# Altium project VL812 QFN76 HUB P4 BC DEMO 20120829.PrjPcb
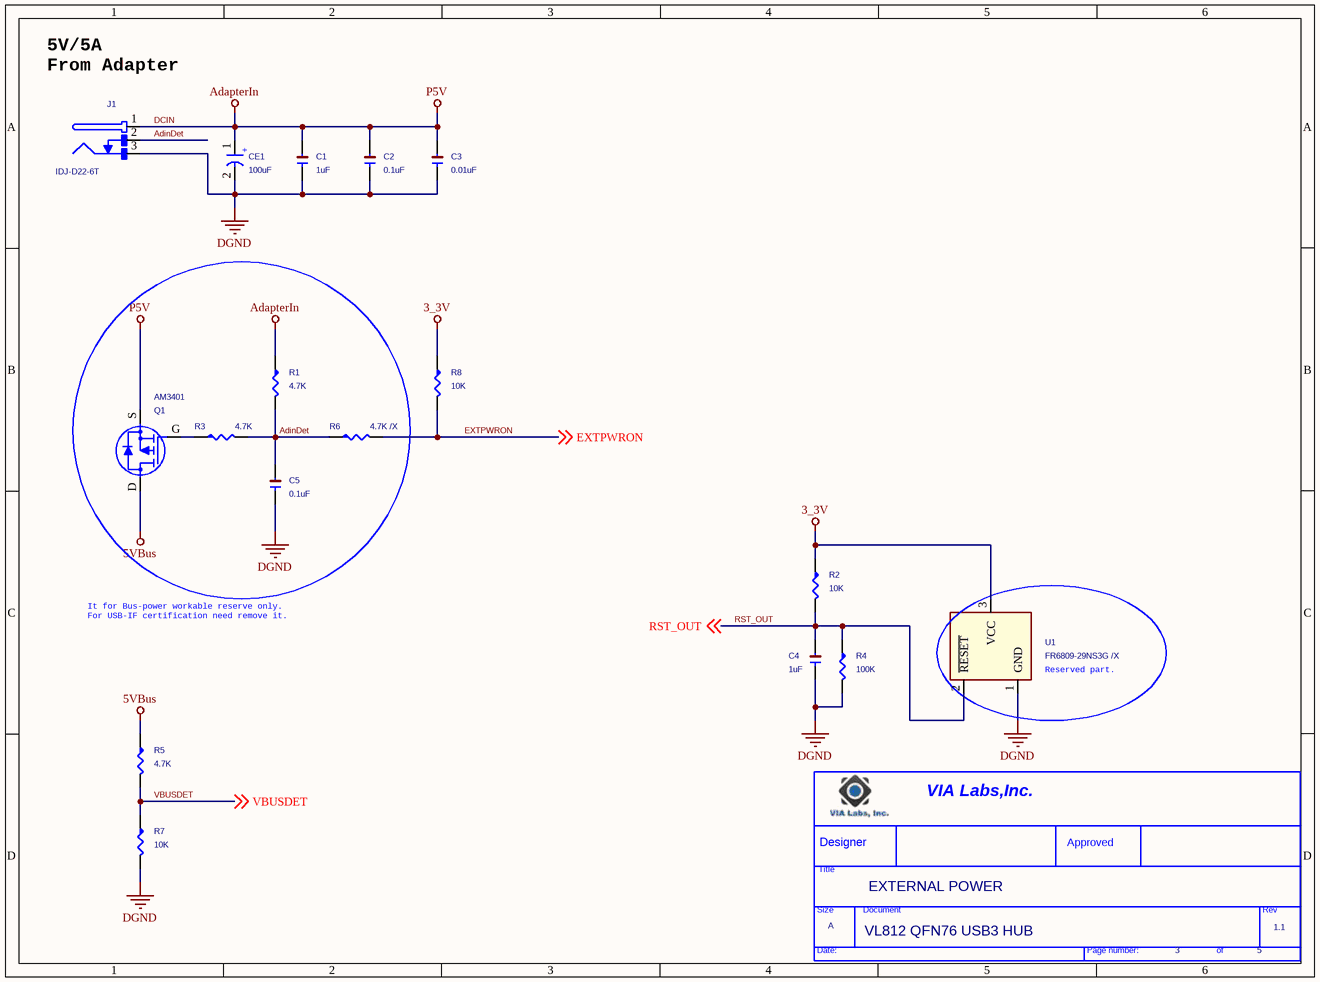
[diagram p0: 01.SchDoc]
3 sheets, 109 parts. Net scope: global (net labels, ports and power ports of the same name join across sheets).
Board file: VL812 USB3.0 .PcbDoc
Sheets:
  01.SchDoc
  02.SchDoc
  03.SchDoc

## Sheet 01.SchDoc
size 246 x 182 mm

### Parts
(Parts that share a designator on the sheet are numbered #1, #2 ... from top to bottom, then left to right.)
*#1  Page Count: 5  Page Number: 3  Page Size: A  Title: EXTERNAL POWER  RevCode: 1.1  Doc: VL812 QFN76 USB3 HUB  (hidden comment: TitleBlock0)  (graphical)
C1  1uF  [1206]
C2  0.1uF  [1206]
C3  0.01uF  [1206]
C4  1uF  [1206]
C5  0.1uF  [1206]
CE1  100uF  [EC5X7-80]
J1  IDJ-D22-6T  [DCJACK-IDJ-D22-6T]
Q1  AM3401  [sot23-gds]
R1  4.7K  [RES0402]
R2  10K  [RES0402]
R3  4.7K  [RES0402]
R4  100K  [RES0402]
R5  4.7K  [RES0402]
R6  4.7K /X  [RES0402]
R7  10K  [RES0402]
R8  10K  [RES0402]
U1  FR6809-29NS3G /X  [SOT23-132]

### Nets
3_3V: R2.1 R8.1 U1.3(VCC)
5VBus: Q1.D(DRAIN) R5.1
DCIN: C1.2 C2.2 C3.2 CE1.1(+) J1.1 Q1.S(SOURCE) R1.1  [also labelled AdapterIn, P5V]
DGND: C1.1 C2.1 C3.1 C4.1 C5.1 CE1.2(-) J1.3 R4.2 R7.2 U1.1(GND)  [project net TESTEN]
AdinDet: C5.2 J1.2 R1.2 R3.2 R6.1
EXTPWRON: R6.2 R8.2 ; off-sheet EXTPWRON
RST_OUT: C4.2 R2.2 R4.1 U1.2(~{RESET}) ; off-sheet RST_OUT
VBUSDET: R5.2 R7.1 ; off-sheet VBUSDET
NetQ1_G: Q1.G(GATE) R3.1

### Notes on the sheet
- (near J1) 5V/5A
  From Adapter
- It for Bus-power workable reserve only.
  For USB-IF certification need remove it.
- (near U1) Reserved part.
- (in symbol TitleBlock0) VIA Labs,Inc.; Designer; Approved; Title; Size; Document; Rev; Date:; Page number:; of

### Library data of the parts
C1 C4 = C: Part Number: 99G12-00009B; DSCX: CAP ML 1 uF Z 10V Y5V SMT0603,THICKNESS=0.80∮0.10mm C1608Y5V105ZDT DARFON; QUAN: 13000; Qualify: YES; Dsc8: DARFON; Dsc7: C1608Y5V105ZDT; Dsc6: SMT0603,THICKNESS=0.80∮0.10mm; Dsc5: Y5V; Dsc4: 10V; Dsc3: Z; Dsc1: CAP ML; approval status: A; 弧: CAP ML 1 uF Z 10V Y5V SMT0603,; ID: 17426; Date: 12302002; Cost: 0.00; Part Type: SMD CAP; Dsc2: 1 uF
C2 = C: Part Number: 99G12-006525; ID: 16,890; 弧: CAP ML0.1 uFZ16VY5VSMT0402,THICKNESS=0.50∮0.05mmCC; approval status: A; Dsc1: CAP ML; Dsc3: K; Dsc4: 16V; Dsc5: X5R; Dsc6: SMT0402,THICKNESS=0.50mm; Dsc7: EMK105BJ104KV; Dsc8: TAIYO; Qualify: YES; QUAN: 34,490; DSCX: CAP ML 0.1 uF K 16V X5R SMT0402,THICKNESS=0.50mm EMK105BJ104KV TAIYO; Date: 12302002; Dsc2: 0.1 uF; Part Type: SMD CAP; Cost: 0
C3 = C: Part Number: 99G12-005696; DSCX: CAP ML 0.01 uF Z 16V Y5V SMT0402,THICKNESS=0.50∮0.05mm CC0402ZRY5V7BB103 YAGEO; QUAN: 10000; Qualify: YES; Dsc8: YAGEO; Dsc7: CC0402ZRY5V7BB103; Dsc6: SMT0402,THICKNESS=0.50∮0.05mm; Dsc5: Y5V; Dsc4: 16V; Dsc3: Z; Dsc1: CAP ML; approval status: NA; 弧: CAP ML0.01 uFZ16VY5VSMT0402,THICKNESS=0.50∮0.05mmC; ID: 17869; Date: 12302002; Cost: 0.00; Part Type: SMD CAP; Dsc2: 0.01 uF
C5 = C: Part Number: 99G12-006525; QUAN: 34,490; Qualify: YES; Dsc8: TAIYO; Dsc7: EMK105BJ104KV; Dsc6: SMT0402,THICKNESS=0.50mm; Dsc5: X5R; Dsc4: 16V; Dsc3: K; Dsc1: CAP ML; approval status: A; 弧: CAP ML0.1 uFZ16VY5VSMT0402,THICKNESS=0.50∮0.05mmCC; ID: 16,890; DSCX: CAP ML 0.1 uF K 16V X5R SMT0402,THICKNESS=0.50mm EMK105BJ104KV TAIYO; Date: 12302002; Cost: 0; Part Type: SMD CAP; Dsc2: 0.1 uF
CE1 = CE: Part Number: 99G15-020132; ID: 18195; 弧: CAP EC 100 uF M 10V 105 DIP P; approval status: A; Dsc1: CAP EC; Dsc3: M; Dsc4: 10V; Dsc5: 105; Dsc6: DIP PIN 5*7*2mm,3.0~3.5mm; Dsc7: ECMI101M0100507EBC; Dsc8: GSC; Qualify: YES; Approval Sheet: \\tp_mi05\BackUp\VPSD\BillYang\VEPD\Data Sheet\99G\99G15-02\99G15-020132.pdf; QUAN: 3845; DSCX: CAP EC 100 uF M 10V 105 DIP PIN 5*7*2mm,3.0~3.5mm ECMI101M0100507EBC GSC; Date: 12302002; Dsc2: 100 uF; Part Type: DIP CAP EC; Cost: 0.01
J1 = DCJack-IDJ-D22-6T_0: Part Number: 99G30-110462; DSCX: CONN JACK DC JACK IDJ-D22-6T 3PIN BLACK 2.5mm DIP/RIGHT ANGLE 翬礨; QUAN: 0; Qualify: YES; Dsc8: 翬礨; Dsc7: DIP/RIGHT ANGLE; Dsc6: 2.5mm; Dsc5: BLACK; Dsc4: 3PIN; Dsc2: DC JACK; Dsc1: CONN JACK; approval status: PL; 弧: CONN JACK DC JACK IDJ-D22-6T 3; ID: 21,793; Date: 11082004; Cost: 0.22; Part Type: DIP CONN; Dsc3: IDJ-D22-6T
Q1 = APM2301AAC-TR_0: Part Number: 99G10-030249; ID: 14098; 弧: TRANSISTOR FET P CHANNEL APM23; approval status: CA; Dsc1: TRANSISTOR FET P CHANNEL; Dsc2: APM2301AAC-TRL; Dsc3: SOT23; Dsc4: 3PIN; Dsc8: ANPEC; Qualify: YES; QUAN: 17271; Date: 11072003; Part Type: SMD TRANSISTOR; Cost: 0.08
R1 R3 R5 R6 = R: Part Number: 99G19-001443; ID: 17,534; 弧: RES CHIP 4.7K OHM J 1/16W CF S; approval status: NA; Dsc1: RES CHIP; Dsc2: 4.7K OHM; Dsc3: J; Dsc4: 1/16W; Dsc5: CF; Dsc6: SMT0402,THICKNESS=0.35∮0.05mm; Dsc7: RC0402JR-074K7L; Dsc8: YAGEO; Qualify: YES; QUAN: 9,320; DSCX: RES CHIP 4.7K OHM J 1/16W CF SMT0402,THICKNESS=0.35∮0.05mm RC0402JR-074K7L YAGEO; Date: 12302002; Part Type: SMD RES; Cost: 0
R2 = R: Part Number: 99G19-001453; QUAN: 15,463; Qualify: YES; Dsc8: YAGEO; Dsc7: RC0402JR-0710KL; Dsc6: SMT0402,THICKNESS=0.35∮0.05mm; Dsc5: CF; Dsc4: 1/16W; Dsc3: J; Dsc2: 10K OHM; Dsc1: RES CHIP; approval status: NA; 弧: RES CHIP 10K OHM J 1/10W CF SM; ID: 17,537; DSCX: RES CHIP 10K OHM J 1/16W CF SMT0402,THICKNESS=0.35∮0.05mm RC0402JR-0710KL YAGEO; Date: 12302002; Cost: 0; Part Type: SMD RES
R4 = R: Part Number: 99G19-001633; QUAN: 108,216; Qualify: YES; Dsc8: YAGEO; Dsc7: RC0402JR-07100KL; Dsc6: SMT0402,THICKNESS=0.35∮0.05mm; Dsc5: CF; Dsc4: 1/16W; Dsc3: J; Dsc2: 100K OHM; Dsc1: RES CHIP; approval status: PL; 弧: RES CHIP 100K OHM J 1/10W CF S; ID: 17,576; DSCX: RES CHIP 100K OHM J 1/16W CF SMT0402,THICKNESS=0.35∮0.05mm RC0402JR-07100KL YAGEO; Date: 12302002; Cost: 0; Part Type: SMD RES
R7 R8 = R: Part Number: 99G19-001453; ID: 17,537; 弧: RES CHIP 10K OHM J 1/10W CF SM; approval status: NA; Dsc1: RES CHIP; Dsc2: 10K OHM; Dsc3: J; Dsc4: 1/16W; Dsc5: CF; Dsc6: SMT0402,THICKNESS=0.35∮0.05mm; Dsc7: RC0402JR-0710KL; Dsc8: YAGEO; Qualify: YES; QUAN: 15,463; DSCX: RES CHIP 10K OHM J 1/16W CF SMT0402,THICKNESS=0.35∮0.05mm RC0402JR-0710KL YAGEO; Date: 12302002; Part Type: SMD RES; Cost: 0
U1 = BAT54C/SOT_0
*#1 = TitleBlock0: Page Create Date: March  8, 1995

## Sheet 02.SchDoc
size 386 x 246 mm
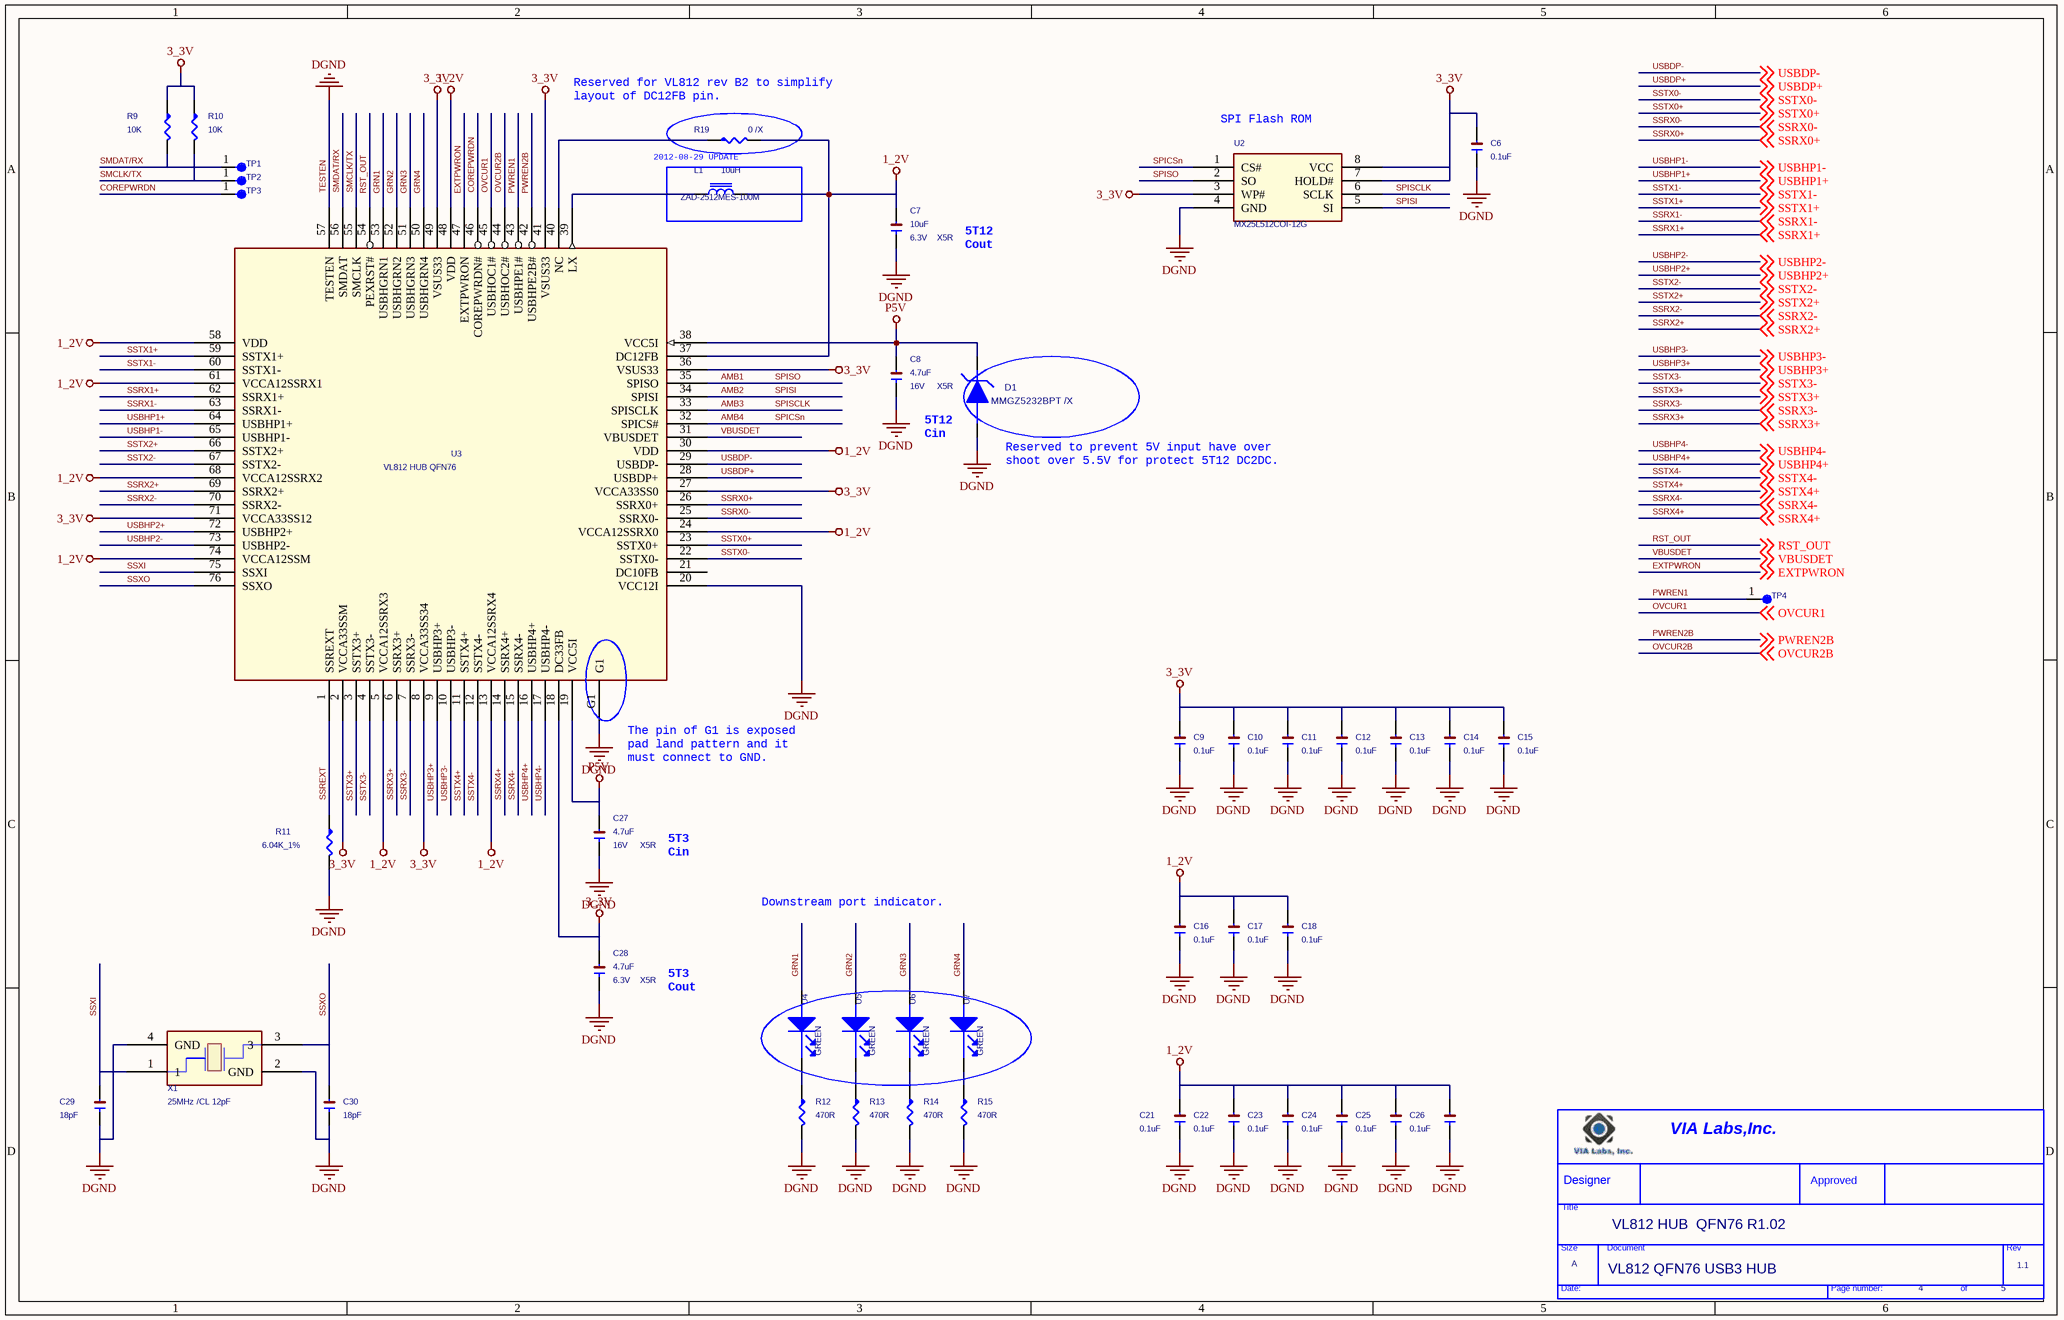
[diagram p1: 02.SchDoc]

### Parts
(Parts that share a designator on the sheet are numbered #1, #2 ... from top to bottom, then left to right.)
*#2  Page Count: 5  Page Number: 4  Page Size: A  Title: VL812 HUB  QFN76 R1.02  RevCode: 1.1  Doc: VL812 QFN76 USB3 HUB  (hidden comment: TitleBlock0)  (graphical)
C6  0.1uF  [1206]
C7  10uF  Dsc4: 6.3V  Dsc5: X5R  [1206]
C8  4.7uF  Dsc4: 16V  Dsc5: X5R  [1206]
C9  0.1uF  [1206]
C10  0.1uF  [1206]
C11  0.1uF  [1206]
C12  0.1uF  [1206]
C13  0.1uF  [1206]
C14  0.1uF  [1206]
C15  0.1uF  [1206]
C16  0.1uF  [1206]
C17  0.1uF  [1206]
C18  0.1uF  [1206]
C21  0.1uF  [1206]
C22  0.1uF  [1206]
C23  0.1uF  [1206]
C24  0.1uF  [1206]
C25  0.1uF  [1206]
C26  0.1uF  [1206]
C27  4.7uF  Dsc4: 16V  Dsc5: X5R  [1206]
C28  4.7uF  Dsc4: 6.3V  Dsc5: X5R  [1206]
C29  18pF  [1206]
C30  18pF  [1206]
D1  MMGZ5232BPT /X  [D-MELF]
L1  ZAD-2512MES-100M  Dsc3: 10uH  [L-ZAD2512]
R9  10K  [RES0402]
R10  10K  [RES0402]
R11  6.04K_1%  [RES0402]
R12  470R  [RES0402]
R13  470R  [RES0402]
R14  470R  [RES0402]
R15  470R  [RES0402]
R19  0 /X  [RES0402]
TP1  TestPoint  [smd_tp_1]  (value not drawn)
TP2  TestPoint  [smd_tp_1]  (value not drawn)
TP3  TestPoint  [smd_tp_1]  (value not drawn)
TP4  TestPoint  [smd_tp_1]  (value not drawn)
U2  MX25L512COI-12G  [TSSOP8-25P6X228]
U3  VL812 HUB QFN76  [QFN76]
U4  Dsc2: GREEN  [LED-LT8A23-51-UR96-T5]  (hidden comment: LT8A23-56-T5)
U5  Dsc2: GREEN  [LED-LT8A23-51-UR96-T5]  (hidden comment: LT8A23-56-T5)
U6  Dsc2: GREEN  [LED-LT8A23-51-UR96-T5]  (hidden comment: LT8A23-56-T5)
U7  Dsc2: GREEN  [LED-LT8A23-51-UR96-T5]  (hidden comment: LT8A23-56-T5)
X1  25MHz /CL 12pF  [OSC4-085X061]

### Nets
1_2V: C7.2 C16.2 C17.2 C18.2 C21.2 C22.2 C23.2 C24.2 C25.2 C26.2 L1.2 R19.2 U3.5(VCCA12SSRX3) U3.13(VCCA12SSRX4) U3.24(VCCA12SSRX0) U3.30(VDD) U3.37(DC12FB) U3.48(VDD) U3.58(VDD) U3.61(VCCA12SSRX1) U3.68(VCCA12SSRX2) U3.74(VCCA12SSM)
3_3V: C6.2 C9.2 C10.2 C11.2 C12.2 C13.2 C14.2 C15.2 C28.2 R9.1 R10.1 U2.3(WP#) U2.7(HOLD#) U2.8(VCC) U3.2(VCCA33SSM) U3.8(VCCA33SS34) U3.18(DC33FB) U3.27(VCCA33SS0) U3.36(VSUS33) U3.41(VSUS33) U3.49(VSUS33) U3.71(VCCA33SS12)
P5V: C8.2 C27.2 D1.K U3.19(VCC5I) U3.38(VCC5I)  [project net DCIN]
TESTEN: C6.1 C7.1 C8.1 C9.1 C10.1 C11.1 C12.1 C13.1 C14.1 C15.1 C16.1 C17.1 C18.1 C21.1 C22.1 C23.1 C24.1 C25.1 C26.1 C27.1 C28.1 C29.1 C30.1 D1.A R11.2 R12.2 R13.2 R14.2 R15.2 U2.4(GND) U3.20(VCC12I) U3.57(TESTEN) U3.G1 X1.2(GND) X1.4(GND)  [also labelled DGND]
AMB1: U2.2(SO) U3.35(SPISO)  [also labelled SPISO]
AMB2: U2.5(SI) U3.34(SPISI)  [also labelled SPISI]
AMB3: U2.6(SCLK) U3.33(SPISCLK)  [also labelled SPISCLK]
AMB4: U2.1(CS#) U3.32(SPICS#)  [also labelled SPICSn]
COREPWRDN: TP3.1 U3.46(COREPWRDN#)
EXTPWRON: U3.47(EXTPWRON) ; off-sheet EXTPWRON
GRN1: U3.53(USBHGRN1) U4.1
GRN2: U3.52(USBHGRN2) U5.1
GRN3: U3.51(USBHGRN3) U6.1
GRN4: U3.50(USBHGRN4) U7.1
OVCUR1: U3.45(USBHOC1#) ; off-sheet OVCUR1
OVCUR2B: U3.44(USBHOC2#) ; off-sheet OVCUR2B
PWREN1: TP4.1 U3.43(USBHPE1#)
PWREN2B: U3.42(USBHPE2B#) ; off-sheet PWREN2B
RST_OUT: U3.54(PEXRST#) ; off-sheet RST_OUT
SMCLK/TX: R10.2 TP2.1 U3.55(SMCLK)
SMDAT/RX: R9.2 TP1.1 U3.56(SMDAT)
SSREXT: R11.1 U3.1(SSREXT)
SSRX0+: U3.26(SSRX0+) ; off-sheet SSRX0+
SSRX0-: U3.25(SSRX0-) ; off-sheet SSRX0-
SSRX1+: U3.62(SSRX1+) ; off-sheet SSRX1+
SSRX1-: U3.63(SSRX1-) ; off-sheet SSRX1-
SSRX2+: U3.69(SSRX2+) ; off-sheet SSRX2+
SSRX2-: U3.70(SSRX2-) ; off-sheet SSRX2-
SSRX3+: U3.6(SSRX3+) ; off-sheet SSRX3+
SSRX3-: U3.7(SSRX3-) ; off-sheet SSRX3-
SSRX4+: U3.14(SSRX4+) ; off-sheet SSRX4+
SSRX4-: U3.15(SSRX4-) ; off-sheet SSRX4-
SSTX0+: U3.23(SSTX0+) ; off-sheet SSTX0+
SSTX0-: U3.22(SSTX0-) ; off-sheet SSTX0-
SSTX1+: U3.59(SSTX1+) ; off-sheet SSTX1+
SSTX1-: U3.60(SSTX1-) ; off-sheet SSTX1-
SSTX2+: U3.66(SSTX2+) ; off-sheet SSTX2+
SSTX2-: U3.67(SSTX2-) ; off-sheet SSTX2-
SSTX3+: U3.3(SSTX3+) ; off-sheet SSTX3+
SSTX3-: U3.4(SSTX3-) ; off-sheet SSTX3-
SSTX4+: U3.11(SSTX4+) ; off-sheet SSTX4+
SSTX4-: U3.12(SSTX4-) ; off-sheet SSTX4-
SSXI: C29.2 U3.75(SSXI) X1.1
SSXO: C30.2 U3.76(SSXO) X1.3
USBDP+: U3.28(USBDP+) ; off-sheet USBDP+
USBDP-: U3.29(USBDP-) ; off-sheet USBDP-
USBHP1+: U3.64(USBHP1+) ; off-sheet USBHP1+
USBHP1-: U3.65(USBHP1-) ; off-sheet USBHP1-
USBHP2+: U3.72(USBHP2+) ; off-sheet USBHP2+
USBHP2-: U3.73(USBHP2-) ; off-sheet USBHP2-
USBHP3+: U3.9(USBHP3+) ; off-sheet USBHP3+
USBHP3-: U3.10(USBHP3-) ; off-sheet USBHP3-
USBHP4+: U3.16(USBHP4+) ; off-sheet USBHP4+
USBHP4-: U3.17(USBHP4-) ; off-sheet USBHP4-
VBUSDET: U3.31(VBUSDET) ; off-sheet VBUSDET
NetL1_1: L1.1 U3.39(LX)
NetR12_1: R12.1 U4.2
NetR13_1: R13.1 U5.2
NetR14_1: R14.1 U6.2
NetR15_1: R15.1 U7.2
NetR19_1: R19.1 U3.40(NC)

Not connected (* = marked no-connect by the designer): U3 21(DC10FB)

### Notes on the sheet
- (near R19) Reserved for VL812 rev B2 to simplify
  layout of DC12FB pin.
- (near U2) SPI Flash ROM
- (near R19) 2012-08-29 UPDATE
- 5T12
  Cout
- (near D1) 5T12
  Cin
- (near D1) Reserved to prevent 5V input have over
  shoot over 5.5V for protect 5T12 DC2DC.
- The pin of G1 is exposed
  pad land pattern and it
  must connect to GND.
- 5T3
  Cin
- Downstream port indicator.
- 5T3
  Cout
- (in symbol TitleBlock0) VIA Labs,Inc.; Designer; Approved; Title; Size; Document; Rev; Date:; Page number:; of

### Library data of the parts
C6 = C: Part Number: 99G12-006525; DSCX: CAP ML 0.1 uF K 16V X5R SMT0402,THICKNESS=0.50mm EMK105BJ104KV TAIYO; ID: 16,890; 弧: CAP ML0.1 uFZ16VY5VSMT0402,THICKNESS=0.50∮0.05mmCC; approval status: A; Dsc1: CAP ML; Dsc3: K; Dsc4: 16V; Dsc5: X5R; Dsc6: SMT0402,THICKNESS=0.50mm; Dsc7: EMK105BJ104KV; Dsc8: TAIYO; Qualify: YES; QUAN: 34,490; Date: 12302002; Dsc2: 0.1 uF; Part Type: SMD CAP; Cost: 0
C7 = C: Part Number: 99G12-001175; ID: 17560; 弧: CAP ML 10 uF M 6.3V X5R SMT060; approval status: A; Dsc1: CAP ML; Dsc3: M; Dsc6: SMT0603,THICKNESS=0.80mm; Dsc7: JMK107BJ106MA-T; Dsc8: TAIYO; Qualify: YES; QUAN: 4660; DSCX: CAP ML 10 uF M 6.3V X5R SMT0603,THICKNESS=0.80mm JMK107BJ106MA-T TAIYO; Date: 12302002; Dsc2: 10 uF; Part Type: SMD CAP; Cost: 0.05
C8 C27 = C: Part Number: 99G12-000775; ID: 17514; 弧: CAP ML 4.7 uF K 16V X5R SMT080; approval status: CA; Dsc1: CAP ML; Dsc3: K; Dsc6: SMT0805,THICKNESS=1.25mm; Dsc7: EMK212BJ475KG-T; Dsc8: TAIYO; Qualify: YES; QUAN: 2820; DSCX: CAP ML 4.7 uF K 16V X5R SMT0805,THICKNESS=1.25mm EMK212BJ475KG-T TAIYO; Date: 12302002; Dsc2: 4.7 uF; Part Type: SMD CAP; Cost: 0.02
C9-C14 C21-C26 = C: as C2 on sheet 01; Date: 12302002; Dsc2: 0.1 uF; Part Type: SMD CAP; Cost: 0
C15-C18 = C: as C5 on sheet 01; Date: 12302002; Cost: 0; Part Type: SMD CAP; Dsc2: 0.1 uF
C28 = C: Part Number: 99G12-000636; ID: 17494; 弧: CAP ML4.7 uFK6.3VX5RSMT0603,THICKNESS=0.80∮0.10mmC; approval status: NA; Dsc1: CAP ML; Dsc3: K; Dsc6: SMT0603,THICKNESS=0.80∮0.10mm; Dsc7: CC0603KRX5R5BB475; Dsc8: YAGEO; Qualify: YES; QUAN: 2261; DSCX: CAP ML 4.7 uF K 6.3V X5R SMT0603,THICKNESS=0.80∮0.10mm CC0603KRX5R5BB475 YAGEO; Date: 12302002; Dsc2: 4.7 uF; Part Type: SMD CAP; Cost: 0.02
C29 C30 = C: Part Number: 99G12-00478B; ID: 16,794; 弧: CAP ML 18 pF J 50V NPO SMT0402; approval status: A; Dsc1: CAP ML; Dsc3: J; Dsc4: 50V; Dsc5: NPO; Dsc6: SMT0402,THICKNESS=0.50∮0.05mm; Dsc7: C1005NP0180JGT; Dsc8: DARFON; Qualify: YES; QUAN: 147,635; DSCX: CAP ML 18 pF J 50V NPO SMT0402,THICKNESS=0.50∮0.05mm C1005NP0180JGT DARFON; Date: 12302002; Dsc2: 18 pF; Part Type: SMD CAP; Cost: 0
D1 = SS22_0: PART DESC: 2A 20V Schottky Rectifier; OriginalSymbolOrigin: (96,200); HETERO: DIOZ-H,(DIOZ-V); MFG: FAIRCHILD; REF: SS22
L1 = INDUCTOR: ID: 9302; 弧: INDUCTOR SPC-04702-100 10uH N; approval status: PL; Dsc2: SPC-04702-100; Dsc4: N; Dsc5: 1.02A; Dsc6: 4.7*4.7*2mm; Dsc8: TMP; Qualify: YES; Approval Sheet: \\tp_mi05\BackUp\VPSD\Data Sheet\Data Sheet\99-23-03\99-23-02193G.pdf; QUAN: 0; Date: 12302002; Dsc1: INDUCTOR; Part Type: SMD INDUCTOR; Cost: 0.21
R9 R10 = R: Part Number: 99G19-001453; DSCX: RES CHIP 10K OHM J 1/16W CF SMT0402,THICKNESS=0.35∮0.05mm RC0402JR-0710KL YAGEO; ID: 17,537; 弧: RES CHIP 10K OHM J 1/10W CF SM; approval status: NA; Dsc1: RES CHIP; Dsc2: 10K OHM; Dsc3: J; Dsc4: 1/16W; Dsc5: CF; Dsc6: SMT0402,THICKNESS=0.35∮0.05mm; Dsc7: RC0402JR-0710KL; Dsc8: YAGEO; Qualify: YES; QUAN: 15,463; Date: 12302002; Part Type: SMD RES; Cost: 0
R11 = R: Part Number: 99G20-007211; QUAN: 61,736; Qualify: YES; Dsc8: YAGEO; Dsc7: RC0402JR-075K1L; Dsc6: SMT0402,THICKNESS=0.35∮0.05mm; Dsc5: CF; Dsc4: 1/16W; Dsc3: F; Dsc2: 6.04K OHM; Dsc1: RES CHIP; approval status: PL; 弧: RES CHIP 5.1K OHM J 1/16W CF S; ID: 18,915; DSCX: RES CHIP 5.1K OHM J 1/16W CF SMT0402,THICKNESS=0.35∮0.05mm RC0402JR-075K1L YAGEO; Date: 12302002; Cost: 0; Part Type: SMD RES
R12-R15 = R: Part Number: 99G19-001583; QUAN: 66,132; Qualify: YES; Dsc8: YAGEO; Dsc7: RC0402JR-07470RL; Dsc6: SMT0402,THICKNESS=0.35∮0.05mm; Dsc5: CF; Dsc4: 1/16W; Dsc3: J; Dsc2: 470 OHM; Dsc1: RES CHIP; approval status: PL; 弧: RES CHIP 470 OHM J 1/16W CF SM; ID: 17,562; DSCX: RES CHIP 470 OHM J 1/16W CF SMT0402,THICKNESS=0.35∮0.05mm RC0402JR-07470RL YAGEO; Date: 12302002; Cost: 0; Part Type: SMD RES
R19 = R: Part Number: 99G19-001423; ID: 17,528; 弧: RES CHIP 0 OHM J 1/16W CF SMT0; approval status: NA; Dsc1: RES CHIP; Dsc2: 0 OHM; Dsc3: J; Dsc4: 1/16W; Dsc5: CF; Dsc6: SMT0402,THICKNESS=0.35∮0.05mm; Dsc7: RC0402JR-070RL; Dsc8: YAGEO; Qualify: YES; QUAN: 6,104; DSCX: RES CHIP 0 OHM J 1/16W CF SMT0402,THICKNESS=0.35∮0.05mm RC0402JR-070RL YAGEO; Date: 12302002; Part Type: SMD RES; Cost: 0
TP1-TP4 = TestPoint: Part Number: CAD; Date: 12302002
U2 = MX25L512COI-12G: Part Number: 99G02-06215D; ID: 12913; 弧: IC FLASH ROM MX25L512COI-12G 5; approval status: PL; Dsc1: IC FLASH ROM; Dsc3: 512Kbit; Dsc4: TSSOP; Dsc5: 8PIN; Dsc8: MXIC; Qualify: YES; QUAN: 0; Date: 04282009; Dsc2: MX25L512COI-12G; Part Type: SMD IC; Cost: 0.00
U3 = VT3470 HUB QFN76_V1_4.02
U4-U7 = LED-LT8A23-51-UR96-T5: Part Number: 99G11-010351; CLASS: IC; QUAN: 2830; Approval Sheet: \\tp_mi05\BackUp\VPSD\Data Sheet\Data Sheet\99G\99G11-01\99G11-010351.pdf; Qualify: YES; Dsc8: 地砍; Dsc5: 2PAD; Dsc4: SMT0603; Dsc1: LED LAMP; approval status: CA; 弧: LED LAMP GREEN LT8A23-56-T5 SM; ID: 14466; Date: 08022006; Cost: 0.03; Part Type: SMD LED; Dsc3: LT8A23-56-T5
X1 = SMD_CRYSTAL_0: Part Number: 99G08-032284; ID: 15770; 弧: CRYSTAL 25MHZ ∮30PPM X3S025000; approval status: PL; Dsc3: ∮30PPM; Dsc4: X3S025000FC1H-X; Dsc5: 12PF/RR=60 OHM MAX; Dsc6: 3.2mm*2.5mm*0.7mm; Dsc7: SMD/4PAD; Dsc8: KDS(H.ELE.); Qualify: YES; QUAN: 0; DSCX: CRYSTAL 25MHZ ∮30PPM X3S025000FC1H-X 12PF/RR=60 OHM MAX 3.2mm*2.5mm*0.7mm SMD/4PAD KDS(H.ELE.); Date: 10212004; Dsc1: CRYSTAL; Dsc2: 25MHZ; Part Type: SMD CRYSTAL; Cost: 0.00
*#2 = TitleBlock0: Page Create Date: March  8, 1995

## Sheet 03.SchDoc
size 386 x 246 mm
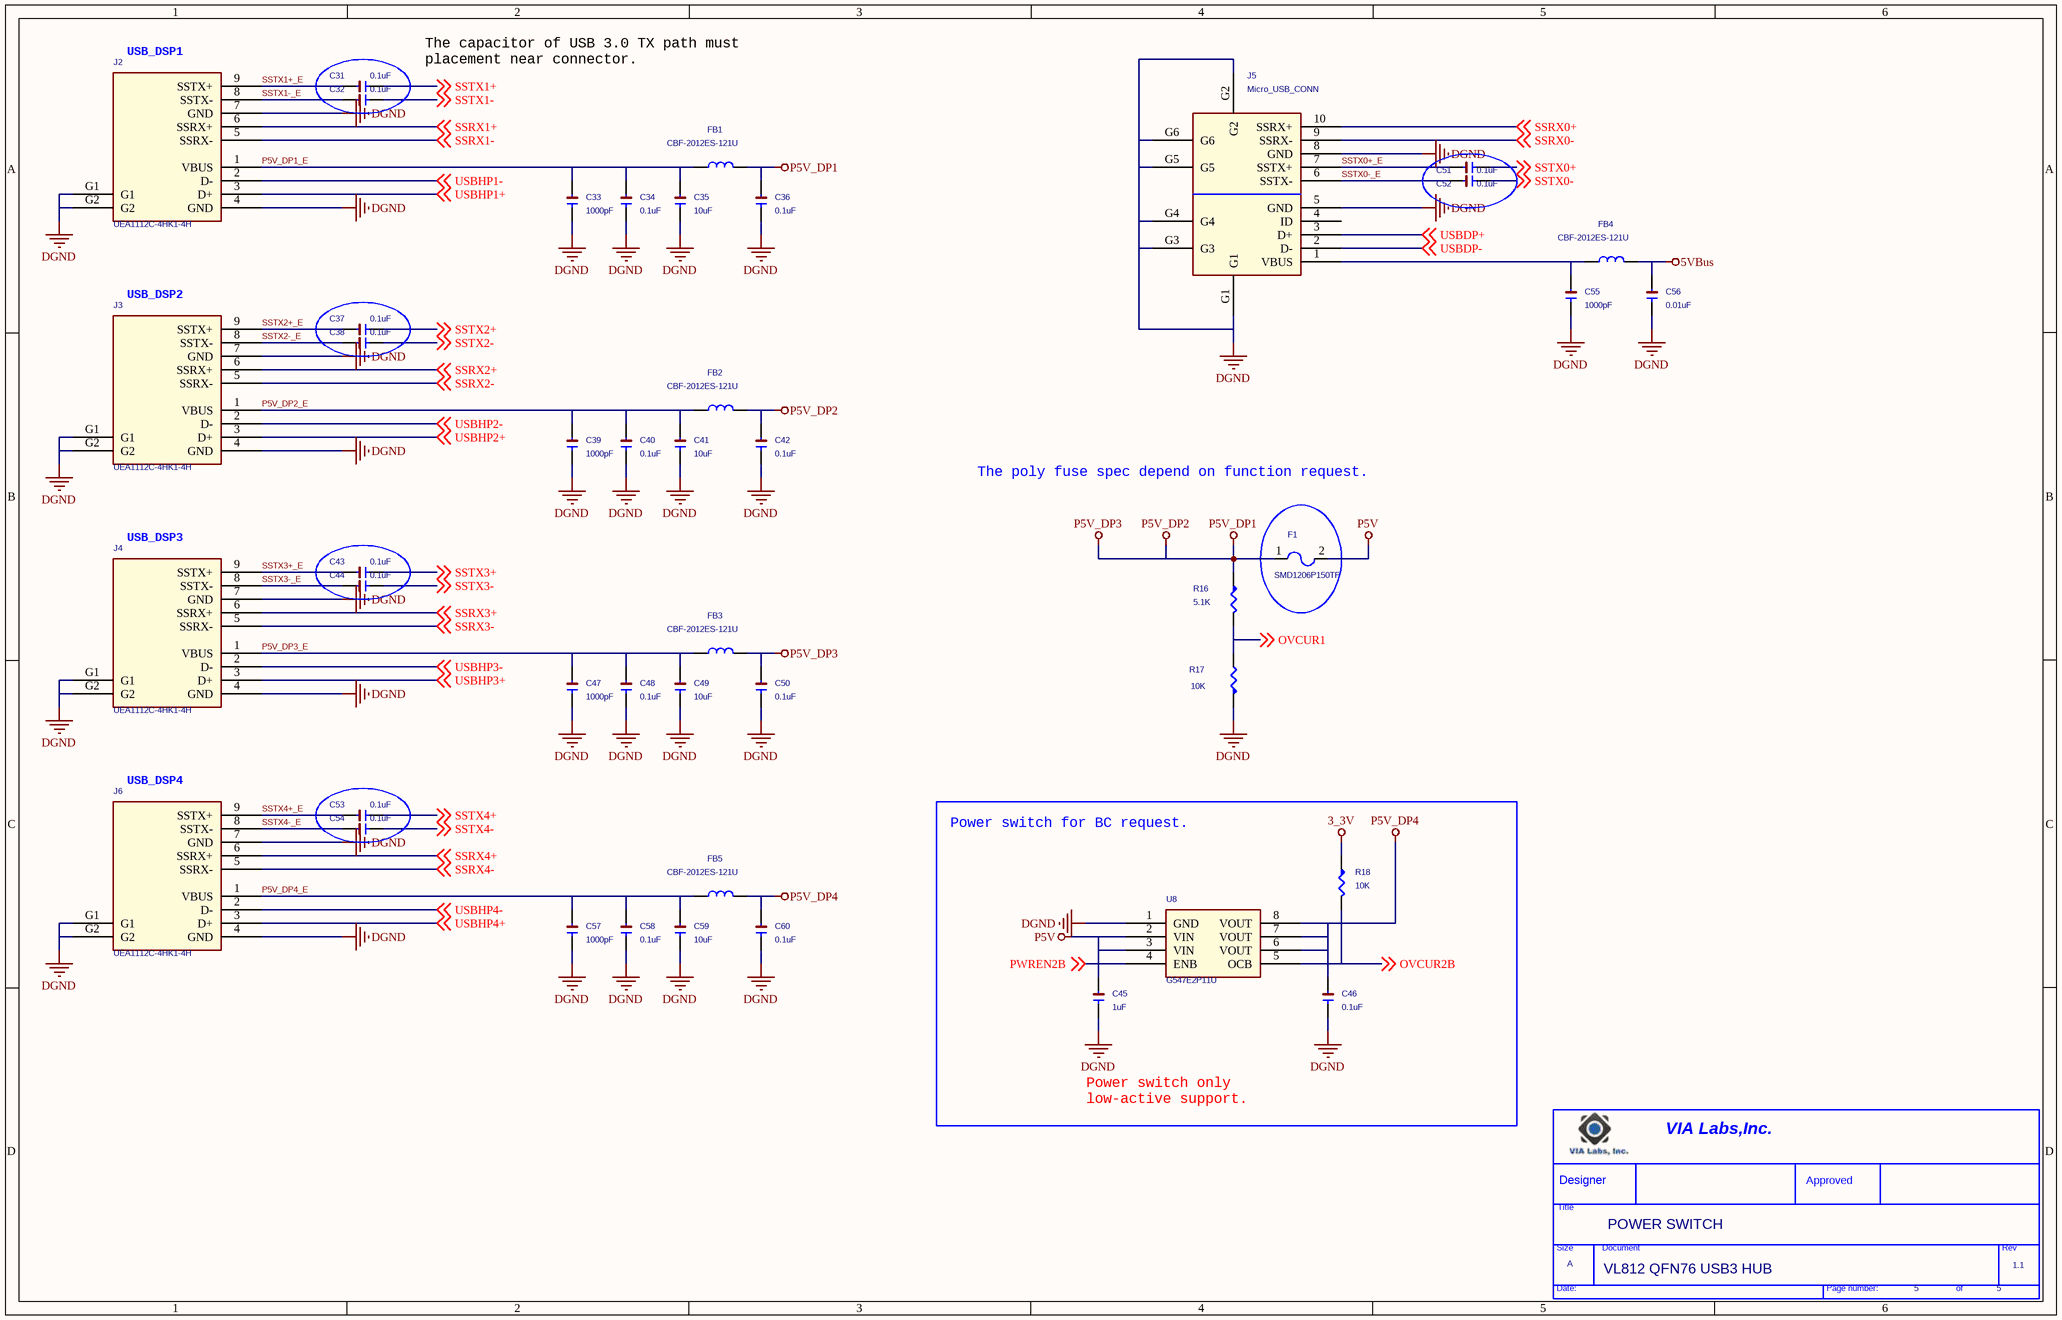
[diagram p2: 03.SchDoc]

### Parts
(Parts that share a designator on the sheet are numbered #1, #2 ... from top to bottom, then left to right.)
*#3  Page Count: 5  Page Size: A  Title: POWER SWITCH  RevCode: 1.1  Doc: VL812 QFN76 USB3 HUB  (hidden comment: TitleBlock0)  (graphical)
C31  0.1uF  [1206]
C32  0.1uF  [1206]
C33  1000pF  [1206]
C34  0.1uF  [1206]
C35  10uF  [1206]
C36  0.1uF  [1206]
C37  0.1uF  [1206]
C38  0.1uF  [1206]
C39  1000pF  [1206]
C40  0.1uF  [1206]
C41  10uF  [1206]
C42  0.1uF  [1206]
C43  0.1uF  [1206]
C44  0.1uF  [1206]
C45  1uF  [1206]
C46  0.1uF  [1206]
C47  1000pF  [1206]
C48  0.1uF  [1206]
C49  10uF  [1206]
C50  0.1uF  [1206]
C51  0.1uF  [1206]
C52  0.1uF  [1206]
C53  0.1uF  [1206]
C54  0.1uF  [1206]
C55  1000pF  [1206]
C56  0.01uF  [1206]
C57  1000pF  [1206]
C58  0.1uF  [1206]
C59  10uF  [1206]
C60  0.1uF  [1206]
F1  SMD1206P150TF  [FUSE1206]
FB1  CBF-2012ES-121U  [BEAD-CB-2012ES]
FB2  CBF-2012ES-121U  [BEAD-CB-2012ES]
FB3  CBF-2012ES-121U  [BEAD-CB-2012ES]
FB4  CBF-2012ES-121U  [BEAD-CB-2012ES]
FB5  CBF-2012ES-121U  [BEAD-CB-2012ES]
J2  UEA1112C-4HK1-4H  [USB-UEA11123-4HK1-4H]
J3  UEA1112C-4HK1-4H  [USB-UEA11123-4HK1-4H]
J4  UEA1112C-4HK1-4H  [USB-UEA11123-4HK1-4H]
J5  Micro_USB_CONN  [MicroUSB-B-S_D]
J6  UEA1112C-4HK1-4H  [USB-UEA11123-4HK1-4H]
R16  5.1K  [RES0402]
R17  10K  [RES0402]
R18  10K  [RES0402]
U8  G547E2P11U  [SOP-8]

### Blocks framed on the sheet
Power switch for BC request.: C45 C46 R18 U8

### Nets
3_3V: R18.1
5VBus: C56.2 FB4.2
DGND: C33.1 C34.1 C35.1 C36.1 C39.1 C40.1 C41.1 C42.1 C45.1 C46.1 C47.1 C48.1 C49.1 C50.1 C55.1 C56.1 C57.1 C58.1 C59.1 C60.1 J2.4(GND) J2.7(GND) J2.G1 J2.G2 J3.4(GND) J3.7(GND) J3.G1 J3.G2 J4.4(GND) J4.7(GND) J4.G1 J4.G2 J5.5(GND) J5.8(GND) J5.G1 J5.G2 J5.G3 J5.G4 J5.G5 J5.G6 J6.4(GND) J6.7(GND) J6.G1 J6.G2 R17.1 U8.1(GND)  [project net TESTEN]
P5V: C45.2 F1.2 U8.2(VIN) U8.3(VIN)  [project net DCIN]
P5V_DP1: C36.2 C42.2 C50.2 F1.1 FB1.2 FB2.2 FB3.2 R16.1  [also labelled P5V_DP2, P5V_DP3]
P5V_DP4: C46.2 C60.2 FB5.2 U8.6(VOUT) U8.7(VOUT) U8.8(VOUT)
OVCUR1: R16.2 R17.2 ; off-sheet OVCUR1
OVCUR2B: R18.2 U8.5(OCB) ; off-sheet OVCUR2B
P5V_DP1_E: C33.2 C34.2 C35.2 FB1.1 J2.1(VBUS)
P5V_DP2_E: C39.2 C40.2 C41.2 FB2.1 J3.1(VBUS)
P5V_DP3_E: C47.2 C48.2 C49.2 FB3.1 J4.1(VBUS)
P5V_DP4_E: C57.2 C58.2 C59.2 FB5.1 J6.1(VBUS)
PWREN2B: U8.4(ENB) ; off-sheet PWREN2B
SSRX0+: J5.10(SSRX+) ; off-sheet SSRX0+
SSRX0-: J5.9(SSRX-) ; off-sheet SSRX0-
SSRX1+: J2.6(SSRX+) ; off-sheet SSRX1+
SSRX1-: J2.5(SSRX-) ; off-sheet SSRX1-
SSRX2+: J3.6(SSRX+) ; off-sheet SSRX2+
SSRX2-: J3.5(SSRX-) ; off-sheet SSRX2-
SSRX3+: J4.6(SSRX+) ; off-sheet SSRX3+
SSRX3-: J4.5(SSRX-) ; off-sheet SSRX3-
SSRX4+: J6.6(SSRX+) ; off-sheet SSRX4+
SSRX4-: J6.5(SSRX-) ; off-sheet SSRX4-
SSTX0+: C51.1 ; off-sheet SSTX0+
SSTX0+_E: C51.2 J5.7(SSTX+)
SSTX0-: C52.1 ; off-sheet SSTX0-
SSTX0-_E: C52.2 J5.6(SSTX-)
SSTX1+: C31.1 ; off-sheet SSTX1+
SSTX1+_E: C31.2 J2.9(SSTX+)
SSTX1-: C32.1 ; off-sheet SSTX1-
SSTX1-_E: C32.2 J2.8(SSTX-)
SSTX2+: C37.1 ; off-sheet SSTX2+
SSTX2+_E: C37.2 J3.9(SSTX+)
SSTX2-: C38.1 ; off-sheet SSTX2-
SSTX2-_E: C38.2 J3.8(SSTX-)
SSTX3+: C43.1 ; off-sheet SSTX3+
SSTX3+_E: C43.2 J4.9(SSTX+)
SSTX3-: C44.1 ; off-sheet SSTX3-
SSTX3-_E: C44.2 J4.8(SSTX-)
SSTX4+: C53.1 ; off-sheet SSTX4+
SSTX4+_E: C53.2 J6.9(SSTX+)
SSTX4-: C54.1 ; off-sheet SSTX4-
SSTX4-_E: C54.2 J6.8(SSTX-)
USBDP+: J5.3(D+) ; off-sheet USBDP+
USBDP-: J5.2(D-) ; off-sheet USBDP-
USBHP1+: J2.3(D+) ; off-sheet USBHP1+
USBHP1-: J2.2(D-) ; off-sheet USBHP1-
USBHP2+: J3.3(D+) ; off-sheet USBHP2+
USBHP2-: J3.2(D-) ; off-sheet USBHP2-
USBHP3+: J4.3(D+) ; off-sheet USBHP3+
USBHP3-: J4.2(D-) ; off-sheet USBHP3-
USBHP4+: J6.3(D+) ; off-sheet USBHP4+
USBHP4-: J6.2(D-) ; off-sheet USBHP4-
NetC55_2: C55.2 FB4.1 J5.1(VBUS)

Not connected (* = marked no-connect by the designer): J5 4(ID)

### Notes on the sheet
- (near J2) USB_DSP1
- The capacitor of USB 3.0 TX path must
  placement near connector.
- (near J3) USB_DSP2
- The poly fuse spec depend on function request.
- (near J4) USB_DSP3
- (near J6) USB_DSP4
- Power switch only
  low-active support.
- (in symbol TitleBlock0) VIA Labs,Inc.; Designer; Approved; Title; Size; Document; Rev; Date:; Page number:; of

### Library data of the parts
C31 C32 C34 C36-C38 C40 C42-C44 C46 C48 C50 C58 C60 = C: as C5 on sheet 01; Date: 12302002; Cost: 0; Part Type: SMD CAP; Dsc2: 0.1 uF
C33 C39 C47 C55 C57 = C: Part Number: 99G12-005476; ID: 17853; 弧: CAP ML1000 pFK50VX7RSMT0402,THICKNESS=0.50∮0.05mmC; approval status: NA; Dsc1: CAP ML; Dsc3: K; Dsc4: 50V; Dsc5: X7R; Dsc6: SMT0402,THICKNESS=0.50∮0.05mm; Dsc7: CC0402KRX7R9BB102; Dsc8: YAGEO; Qualify: YES; QUAN: 6933; DSCX: CAP ML 1000 pF K 50V X7R SMT0402,THICKNESS=0.50∮0.05mm CC0402KRX7R9BB102 YAGEO; Date: 12302002; Dsc2: 1000 pF; Part Type: SMD CAP; Cost: 0.00
C35 C41 C49 C59 = C: Part Number: 99G12-00037B; ID: 17481; 弧: CAP ML 10 uF Z 16V Y5V SMT1210; approval status: A; Dsc1: CAP ML; Dsc3: Z; Dsc4: 16V; Dsc5: Y5V; Dsc6: SMT1210,THICKNESS=1.25∮0.20mm; Dsc7: C3225Y5V106ZEP; Dsc8: DARFON; Qualify: YES; QUAN: 11124; DSCX: CAP ML 10 uF Z 16V Y5V SMT1210,THICKNESS=1.25∮0.20mm C3225Y5V106ZEP DARFON; Date: 12302002; Dsc2: 10 uF; Part Type: SMD CAP; Cost: 0.03
C45 = C: Part Number: 99G12-00009B; ID: 17426; 弧: CAP ML 1 uF Z 10V Y5V SMT0603,; approval status: A; Dsc1: CAP ML; Dsc3: Z; Dsc4: 10V; Dsc5: Y5V; Dsc6: SMT0603,THICKNESS=0.80∮0.10mm; Dsc7: C1608Y5V105ZDT; Dsc8: DARFON; Qualify: YES; QUAN: 13000; DSCX: CAP ML 1 uF Z 10V Y5V SMT0603,THICKNESS=0.80∮0.10mm C1608Y5V105ZDT DARFON; Date: 12302002; Dsc2: 1 uF; Part Type: SMD CAP; Cost: 0.00
C51-C54 = C: as C2 on sheet 01; Date: 12302002; Dsc2: 0.1 uF; Part Type: SMD CAP; Cost: 0
C56 = C: Part Number: 99G12-005696; ID: 17869; 弧: CAP ML0.01 uFZ16VY5VSMT0402,THICKNESS=0.50∮0.05mmC; approval status: NA; Dsc1: CAP ML; Dsc3: Z; Dsc4: 16V; Dsc5: Y5V; Dsc6: SMT0402,THICKNESS=0.50∮0.05mm; Dsc7: CC0402ZRY5V7BB103; Dsc8: YAGEO; Qualify: YES; QUAN: 10000; DSCX: CAP ML 0.01 uF Z 16V Y5V SMT0402,THICKNESS=0.50∮0.05mm CC0402ZRY5V7BB103 YAGEO; Date: 12302002; Dsc2: 0.01 uF; Part Type: SMD CAP; Cost: 0.00
F1 = FUSE: Part Number: 99G28-030141; QUAN: 18458; Approval Sheet: \\tp_mi05\BackUp\VPSD\Data Sheet\Data Sheet\99G\99G28-03\99G28-030141.pdf; Qualify: YES; Dsc8: PTTC; Dsc3: 1.5A; Dsc1: SWITCH POLY; approval status: CA; 弧: SWITCH POLY SMD1206P150TF 1.5A; ID: 18715; Date: 01072003; Cost: 0.05; Part Type: SMD FUSE; Dsc4: SMD1206; Dsc2: SMD1206P150TF
FB1-FB5 = BEAD: Part Number: 99G23-04003G; ID: 20,009; 弧: FERRITE BEAD CBF-2012ES-121U 1; approval status: A; Dsc1: FERRITE BEAD; Dsc3: 120 OHM; Dsc4: 25%; Dsc5: 5000mA; Dsc6: SMT0805; Dsc8: C&C; Qualify: YES; Approval Sheet: \\tp_mi05\BackUp\VPSD\Data Sheet\99G\99G23-04\99G23-04003G.pdf; QUAN: 6,805; DSCX: FERRITE BEAD CBF-2012ES-121U 120 OHM 25% 5000mA SMT0805  C&C; Date: 12302002; Dsc2: CBF-2012ES-121U; Part Type: SMD BEAD; Cost: 0
J2-J4 = USB-UEA11123-4HK1-4H: Part Number: 99G30-060617; ID: 19968; 弧: CONN USB SINGLE A TYPE USB 3.0; approval status: PL; Dsc1: CONN USB; Dsc2: SINGLE A TYPE USB 3.0; Dsc4: 9PIN; Dsc5: RIGHT ANGLE; Dsc6: DIP; Dsc7: BLUE; Dsc8: FOXCONN; Qualify: YES; QUAN: 0; Date: 02042009; Dsc3: UEA1112C-4HK1-4H; Part Type: DIP CONN; Cost: 0.90
J5 = USB-UEB11123-2JK1-4H_0: QUAN: 0; Qualify: YES; Dsc8: FOXCONN; Dsc7: BLUE; Dsc6: DIP; Dsc5: RIGHT ANGLE; Dsc4: 9PIN; Dsc3: UEB1112C-2AK1-4H; Dsc2: SINGLE B TYPE USB 3.0; Dsc1: CONN USB; approval status: PL; 弧: CONN USB SINGLE B TYPE USB 3.0; ID: 19328; Date: 02042009; Cost: 2.45; Part Type: DIP CONN
J6 = USB-UEA11123-4HK1-4H: Part Number: 99G30-060617; QUAN: 0; Qualify: YES; Dsc8: FOXCONN; Dsc7: BLUE; Dsc6: DIP; Dsc5: RIGHT ANGLE; Dsc4: 9PIN; Dsc2: SINGLE A TYPE USB 3.0; Dsc1: CONN USB; approval status: PL; 弧: CONN USB SINGLE A TYPE USB 3.0; ID: 19968; Date: 02042009; Cost: 0.90; Part Type: DIP CONN; Dsc3: UEA1112C-4HK1-4H
R16 = R: Part Number: 99G19-002653; QUAN: 81,590; Qualify: YES; Dsc8: YAGEO; Dsc7: RC0402JR-075K1L; Dsc6: SMT0402,THICKNESS=0.35∮0.05mm; Dsc5: CF; Dsc4: 1/16W; Dsc3: J; Dsc2: 5.1K OHM; Dsc1: RES CHIP; approval status: PL; 弧: RES CHIP 5.1K OHM J 1/16W CF S; ID: 17,696; DSCX: RES CHIP 5.1K OHM J 1/16W CF SMT0402,THICKNESS=0.35∮0.05mm RC0402JR-075K1L YAGEO; Date: 12302002; Cost: 0; Part Type: SMD RES
R17 R18 = R: Part Number: 99G19-001453; DSCX: RES CHIP 10K OHM J 1/16W CF SMT0402,THICKNESS=0.35∮0.05mm RC0402JR-0710KL YAGEO; QUAN: 15,463; Qualify: YES; Dsc8: YAGEO; Dsc7: RC0402JR-0710KL; Dsc6: SMT0402,THICKNESS=0.35∮0.05mm; Dsc5: CF; Dsc4: 1/16W; Dsc3: J; Dsc2: 10K OHM; Dsc1: RES CHIP; approval status: NA; 弧: RES CHIP 10K OHM J 1/10W CF SM; ID: 17,537; Date: 12302002; Cost: 0; Part Type: SMD RES
*#3 = TitleBlock0: Page Number: 5; Page Create Date: March  8, 1995

## Nets that join several sheets
3_3V: 01 (R2.1 R8.1 U1.3), 02 (22 pins), 03 (R18.1)
5VBus: 01 (Q1.D R5.1), 03 (C56.2 FB4.2)
DCIN: 01 (7 pins), 02 (5 pins), 03 (C45.2 F1.2 U8.2 U8.3)
TESTEN: 01 (10 pins), 02 (35 pins), 03 (46 pins)
EXTPWRON: 01 (R6.2 R8.2), 02 (U3.47)
OVCUR1: 02 (U3.45), 03 (R16.2 R17.2)
OVCUR2B: 02 (U3.44), 03 (R18.2 U8.5)
PWREN2B: 02 (U3.42), 03 (U8.4)
RST_OUT: 01 (C4.2 R2.2 R4.1 U1.2), 02 (U3.54)
SSRX0+: 02 (U3.26), 03 (J5.10)
SSRX0-: 02 (U3.25), 03 (J5.9)
SSRX1+: 02 (U3.62), 03 (J2.6)
SSRX1-: 02 (U3.63), 03 (J2.5)
SSRX2+: 02 (U3.69), 03 (J3.6)
SSRX2-: 02 (U3.70), 03 (J3.5)
SSRX3+: 02 (U3.6), 03 (J4.6)
SSRX3-: 02 (U3.7), 03 (J4.5)
SSRX4+: 02 (U3.14), 03 (J6.6)
SSRX4-: 02 (U3.15), 03 (J6.5)
SSTX0+: 02 (U3.23), 03 (C51.1)
SSTX0-: 02 (U3.22), 03 (C52.1)
SSTX1+: 02 (U3.59), 03 (C31.1)
SSTX1-: 02 (U3.60), 03 (C32.1)
SSTX2+: 02 (U3.66), 03 (C37.1)
SSTX2-: 02 (U3.67), 03 (C38.1)
SSTX3+: 02 (U3.3), 03 (C43.1)
SSTX3-: 02 (U3.4), 03 (C44.1)
SSTX4+: 02 (U3.11), 03 (C53.1)
SSTX4-: 02 (U3.12), 03 (C54.1)
USBDP+: 02 (U3.28), 03 (J5.3)
USBDP-: 02 (U3.29), 03 (J5.2)
USBHP1+: 02 (U3.64), 03 (J2.3)
USBHP1-: 02 (U3.65), 03 (J2.2)
USBHP2+: 02 (U3.72), 03 (J3.3)
USBHP2-: 02 (U3.73), 03 (J3.2)
USBHP3+: 02 (U3.9), 03 (J4.3)
USBHP3-: 02 (U3.10), 03 (J4.2)
USBHP4+: 02 (U3.16), 03 (J6.3)
USBHP4-: 02 (U3.17), 03 (J6.2)
VBUSDET: 01 (R5.2 R7.1), 02 (U3.31)